# Altium schematic sheet CatToy2.SchDoc
size A4
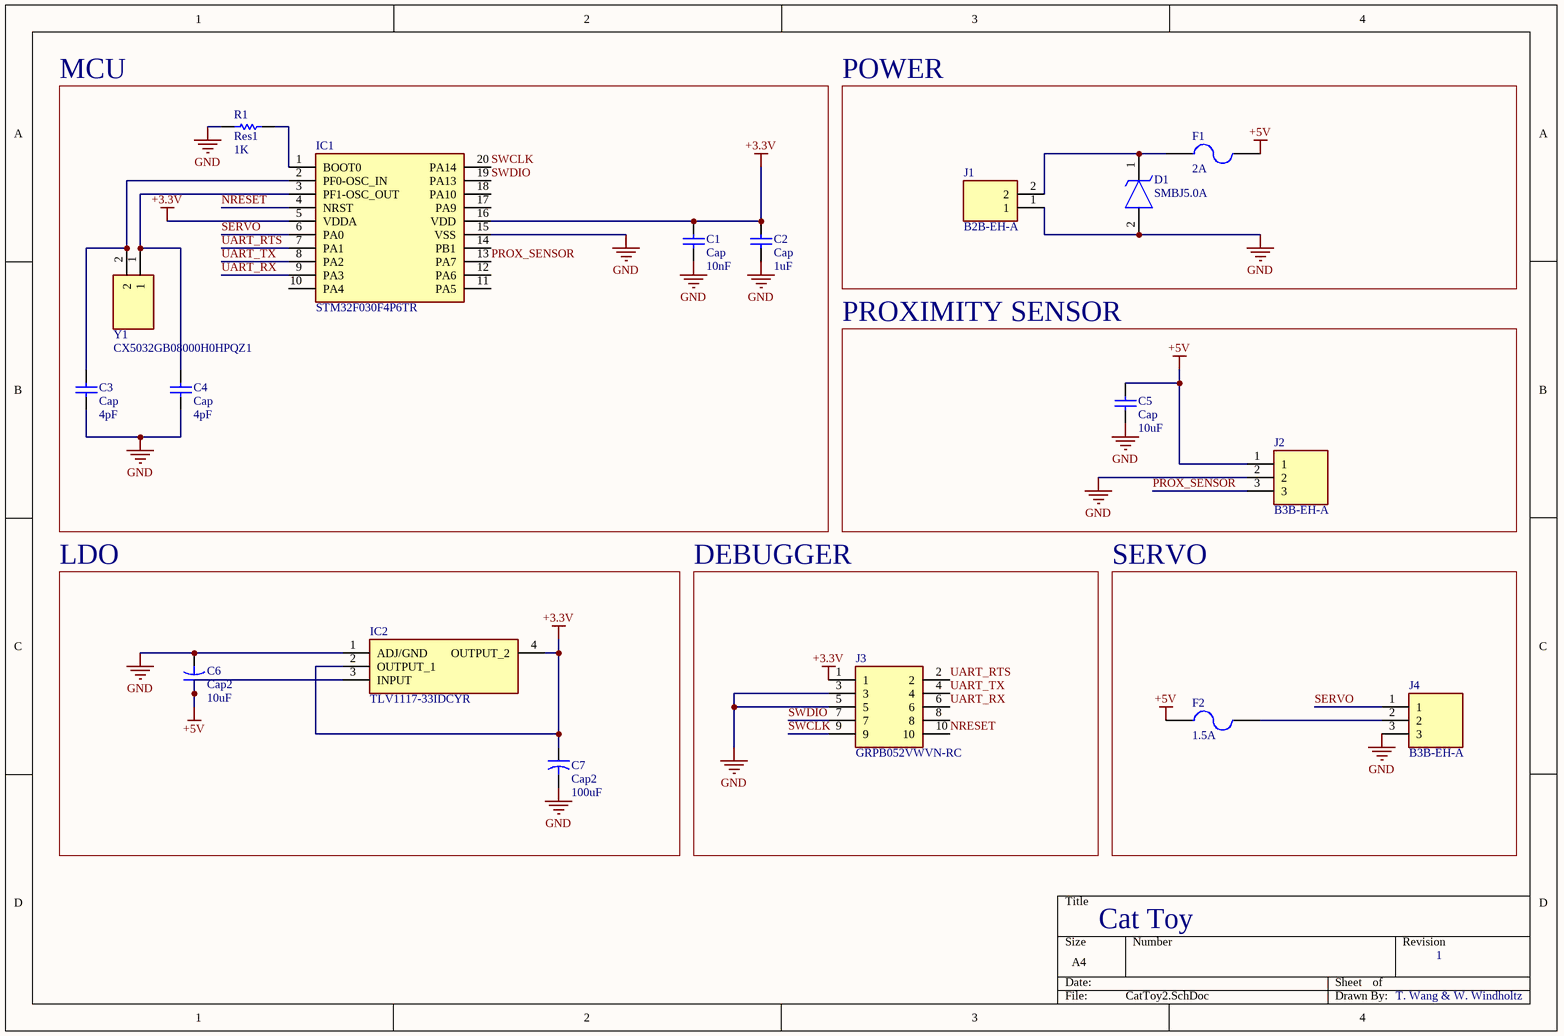
[diagram p0: CatToy2.SchDoc]

## Parts
C1  Cap  value 10nF  [C0805]
C2  Cap  value 1uF  [C0805]
C3  Cap  value 4pF  [C0805]
C4  Cap  value 4pF  [C0805]
C5  Cap  value 10uF  [C0805]
C6  Cap2  value 10uF  [C0805]
C7  Cap2  value 100uF  [C0805]
D1  SMBJ5.0A  [DIOM5436X244N]
F1  2A  [C0805]
F2  1.5A  [C0805]
IC1  STM32F030F4P6TR  [SOP65P640X120-20N]
IC2  TLV1117-33IDCYR  [SOT230P700X180-4N]
J1  B2B-EH-A  [SHDR2W64P0X250_1X2_750X380X600P]
J2  B3B-EH-A  [SHDR3W64P0X250_1X3_1000X380X600P]
J3  GRPB052VWVN-RC  [HDRV10W50P127_2X5_635X340X430P]
J4  B3B-EH-A  [SHDR3W64P0X250_1X3_1000X380X600P]
R1  Res1  value 1K  [C0805]
Y1  CX5032GB08000H0HPQZ1  [CX5032GB08000H0HPQZ1]

## Blocks framed on the sheet
MCU: C1-C4 IC1 R1 Y1
POWER: D1 F1 J1
PROXIMITY SENSOR: C5 J2
LDO: C6 C7 IC2
DEBUGGER: J3
SERVO: F2 J4

## Nets
+3.3V: C1.2 C2.2 C7.1 IC1.5(VDDA) IC1.16(VDD) IC2.2(OUTPUT_1) IC2.4(OUTPUT_2) J3.1
+5V: C5.2 C6.1 F1.2 F2.1 IC2.3(INPUT) J2.1
GND: C1.1 C2.1 C3.1 C4.1 C5.1 C6.2 C7.2 D1.2(A) IC1.15(VSS) IC2.1(ADJ/GND) J1.1 J2.2 J3.3 J3.5 J4.3 R1.1
NRESET: IC1.4(NRST) J3.10
PROX_SENSOR: IC1.13(PA7) J2.3
SERVO: IC1.6(PA0) J4.1
SWCLK: IC1.20(PA14) J3.9
SWDIO: IC1.19(PA13) J3.7
UART_RTS: IC1.7(PA1) J3.2
UART_RX: IC1.9(PA3) J3.6
UART_TX: IC1.8(PA2) J3.4
NetC3_2: C3.2 IC1.2(PF0-OSC_IN) Y1.2
NetC4_2: C4.2 IC1.3(PF1-OSC_OUT) Y1.1
NetD1_1: D1.1(K) F1.1 J1.2
NetF2_2: F2.2 J4.2
NetIC1_1: IC1.1(BOOT0) R1.2

Not connected (* = marked no-connect by the designer): IC1 10(PA4) 11(PA5) 12(PA6) 14(PB1) 17(PA9) 18(PA10); J3 8

## Notes on the sheet
- Cat Toy
- 1
- T. Wang & W. Windholtz

## Library data of the parts
C1-C5 = Cap: Capacitor; Published: 8-Jun-2000; LatestRevisionDate: 17-Jul-2002; LatestRevisionNote: Re-released for DXP Platform.; PackageReference: RAD-0.3; Publisher: Altium Limited; PackageDescription: Radial Cap, Thru-Hole; 2 Leads; 0.3 in Pin Spacing
C6 C7 = Cap2: Capacitor; Published: 23-Sep-2002; PackageReference: CAPR5-4X5; Publisher: Altium Limited; PackageDescription: Capacitor; 2 Leads
D1 = SMBJ5.0A: TVS Diode (Uni-directional); Manufacturer_Name: Vishay; Datasheet Link: http://www.vishay.com/docs/88392/smbj.pdf; Height: 2.44mm; Manufacturer_Part_Number: SMBJ5.0A; Arrow Part Number: SMBJ5.0A
F1 F2 = Fuse 2: Fuse; Published: 8-Jun-2000; LatestRevisionDate: 17-Jul-2002; LatestRevisionNote: Re-released for DXP Platform.; PackageReference: PIN-W2/E2.8; Publisher: Altium Limited; PackageDescription: Thru-Hole; 2 Leads
IC1 = STM32F030F4P6TR: Integrated Circuit; Manufacturer_Name: STMicroelectronics; Datasheet Link: https://www.st.com/resource/en/datasheet/stm32f030rc.pdf; Height: 1.2mm; Manufacturer_Part_Number: STM32F030F4P6TR; Arrow Part Number: STM32F030F4P6TR; Arrow Price/Stock: https://www.arrow.com/en/products/stm32f030f4p6tr/stmicroelectronics; Mouser Part Number: 511-STM32F030F4P6TR; Mouser Price/Stock: https://www.mouser.co.uk/ProductDetail/STMicroelectronics/STM32F030F4P6TR?qs=MavH1QghrkE4yfyLOfvVsw%3D%3D
IC2 = TLV1117-33CDCYR: Integrated Circuit; Manufacturer_Name: Texas Instruments; Datasheet Link: http://www.ti.com/lit/gpn/tlv1117; Height: 1.8mm; Manufacturer_Part_Number: TLV1117-33CDCYR; Arrow Part Number: TLV1117-33CDCYR; Arrow Price/Stock: https://www.arrow.com/en/products/tlv1117-33cdcyr/texas-instruments; Mouser Part Number: 595-TLV1117-33CDCYR; Mouser Price/Stock: https://www.mouser.co.uk/ProductDetail/Texas-Instruments/TLV1117-33CDCYR?qs=p6lVfQR1GSoiRKz8KGIbKg%3D%3D
J1 = B2B-EH-A: Connector; Manufacturer_Name: JST (JAPAN SOLDERLESS TERMINALS); Datasheet Link: http://www.jst-mfg.com/product/pdf/eng/eEH.pdf; Height: 6mm; Manufacturer_Part_Number: B2B-EH-A; Arrow Part Number: B2B-EH-A
J2 J4 = B3B-EH-A: Connector; Manufacturer_Name: JST (JAPAN SOLDERLESS TERMINALS); Datasheet Link: https://datasheet.datasheetarchive.com/originals/dk/DKDS-2/32954.pdf; Height: 6mm; Manufacturer_Part_Number: B3B-EH-A; Arrow Part Number: B3B-EH-A
J3 = GRPB052VWVN-RC: Connector; Manufacturer_Name: Sullins; Datasheet Link: https://media.digikey.com/pdf/Data%20Sheets/Sullins%20PDFs/GRPB_%20_2VWVN-RC%2010954-C.pdf; Height: 4.3mm; Manufacturer_Part_Number: GRPB052VWVN-RC; Arrow Part Number: GRPB052VWVN-RC
R1 = Res1: Resistor; Published: 8-Jun-2000; LatestRevisionDate: 17-Jul-2002; LatestRevisionNote: Re-released for DXP Platform.; PackageReference: AXIAL-0.3; Publisher: Altium Limited; PackageDescription: Axial Device, Thru-Hole; 2 Leads; 0.3 in Pin Spacing
Y1 = CX5032GB08000H0HPQZ1: Crystal or Oscillator; Manufacturer_Name: Kyocera Electronic Components; Datasheet Link: https://media.digikey.com/pdf/Data%20Sheets/AVX%20PDFs/CX5032GB0yyyyyH0HPQZ1_Series_Spec.pdf; Height: 1.1mm; Manufacturer_Part_Number: CX5032GB08000H0HPQZ1; Arrow Part Number: CX5032GB08000H0HPQZ1; Mouser Part Number: 581-CX532GB8HHPQZ1; Mouser Price/Stock: https://www.mouser.co.uk/ProductDetail/Kyocera-Electronic-Components/CX5032GB08000H0HPQZ1?qs=mFMVSnANsC2SO%252B6cjFFj8w%3D%3D